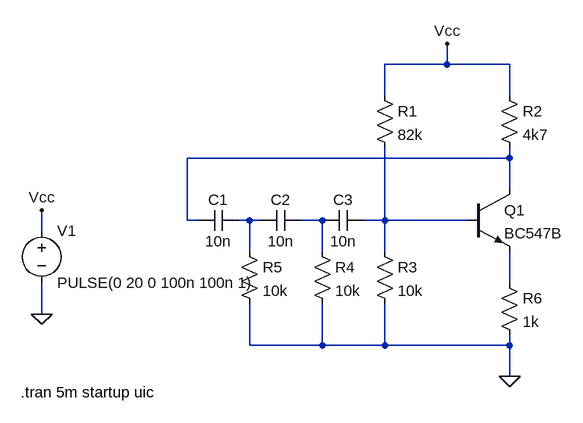
[diagram p0: schematic Simu punto C.asc]
Simu punto C.asc, the LTspice schematic file:
Version 4
SHEET 1 880 680
WIRE 400 -160 400 -192
WIRE 400 -160 304 -160
WIRE 496 -160 400 -160
WIRE 304 -112 304 -160
WIRE 496 -112 496 -160
WIRE 496 -16 496 -32
WIRE 496 -16 0 -16
WIRE 496 32 496 -16
WIRE 0 80 0 -16
WIRE 16 80 0 80
WIRE 96 80 80 80
WIRE 112 80 96 80
WIRE 208 80 176 80
WIRE 304 80 304 -32
WIRE 304 80 272 80
WIRE 432 80 304 80
WIRE -224 96 -224 64
WIRE 96 128 96 80
WIRE 208 128 208 80
WIRE 304 128 304 80
WIRE 496 176 496 128
WIRE -224 224 -224 176
WIRE 96 272 96 208
WIRE 208 272 208 208
WIRE 208 272 96 272
WIRE 304 272 304 208
WIRE 304 272 208 272
WIRE 496 272 496 256
WIRE 496 272 304 272
WIRE 496 320 496 272
FLAG -224 224 0
FLAG -224 64 Vcc
FLAG 496 320 0
FLAG 400 -192 Vcc
SYMBOL voltage -224 80 R0
WINDOW 123 0 0 Left 0
WINDOW 39 0 0 Left 0
SYMATTR InstName V1
SYMATTR Value PULSE(0 20 0 100n 100n 1)
SYMBOL npn 432 32 R0
SYMATTR InstName Q1
SYMATTR Value BC547B
SYMBOL res 288 -128 R0
SYMATTR InstName R1
SYMATTR Value 82k
SYMBOL res 480 -128 R0
SYMATTR InstName R2
SYMATTR Value 4k7
SYMBOL res 288 112 R0
SYMATTR InstName R3
SYMATTR Value 10k
SYMBOL res 192 112 R0
SYMATTR InstName R4
SYMATTR Value 10k
SYMBOL res 80 112 R0
SYMATTR InstName R5
SYMATTR Value 10k
SYMBOL cap 80 64 R90
WINDOW 0 0 32 VBottom 2
WINDOW 3 32 32 VTop 2
SYMATTR InstName C1
SYMATTR Value 10n
SYMBOL cap 176 64 R90
WINDOW 0 0 32 VBottom 2
WINDOW 3 32 32 VTop 2
SYMATTR InstName C2
SYMATTR Value 10n
SYMBOL cap 272 64 R90
WINDOW 0 0 32 VBottom 2
WINDOW 3 32 32 VTop 2
SYMATTR InstName C3
SYMATTR Value 10n
SYMBOL res 480 160 R0
SYMATTR InstName R6
SYMATTR Value 1k
TEXT -256 344 Left 2 !.tran 5m startup uic

The netlist it stands for:
* Simu punto C.asc
V1 Vcc 0 PULSE(0 20 0 100n 100n 1)
Q1 N001 N004 N005 0 BC547B
R1 Vcc N004 82k
R2 Vcc N001 4k7
R3 N004 0 10k
R4 N003 0 10k
R5 N002 0 10k
C1 N002 N001 10n
C2 N003 N002 10n
C3 N004 N003 10n
R6 N005 0 1k
.model NPN NPN
.model PNP PNP
.lib standard.bjt
.tran 5m startup uic
.backanno
.end